# EAGLE schematic mainboard-v1 (EAGLE 7.5.0)
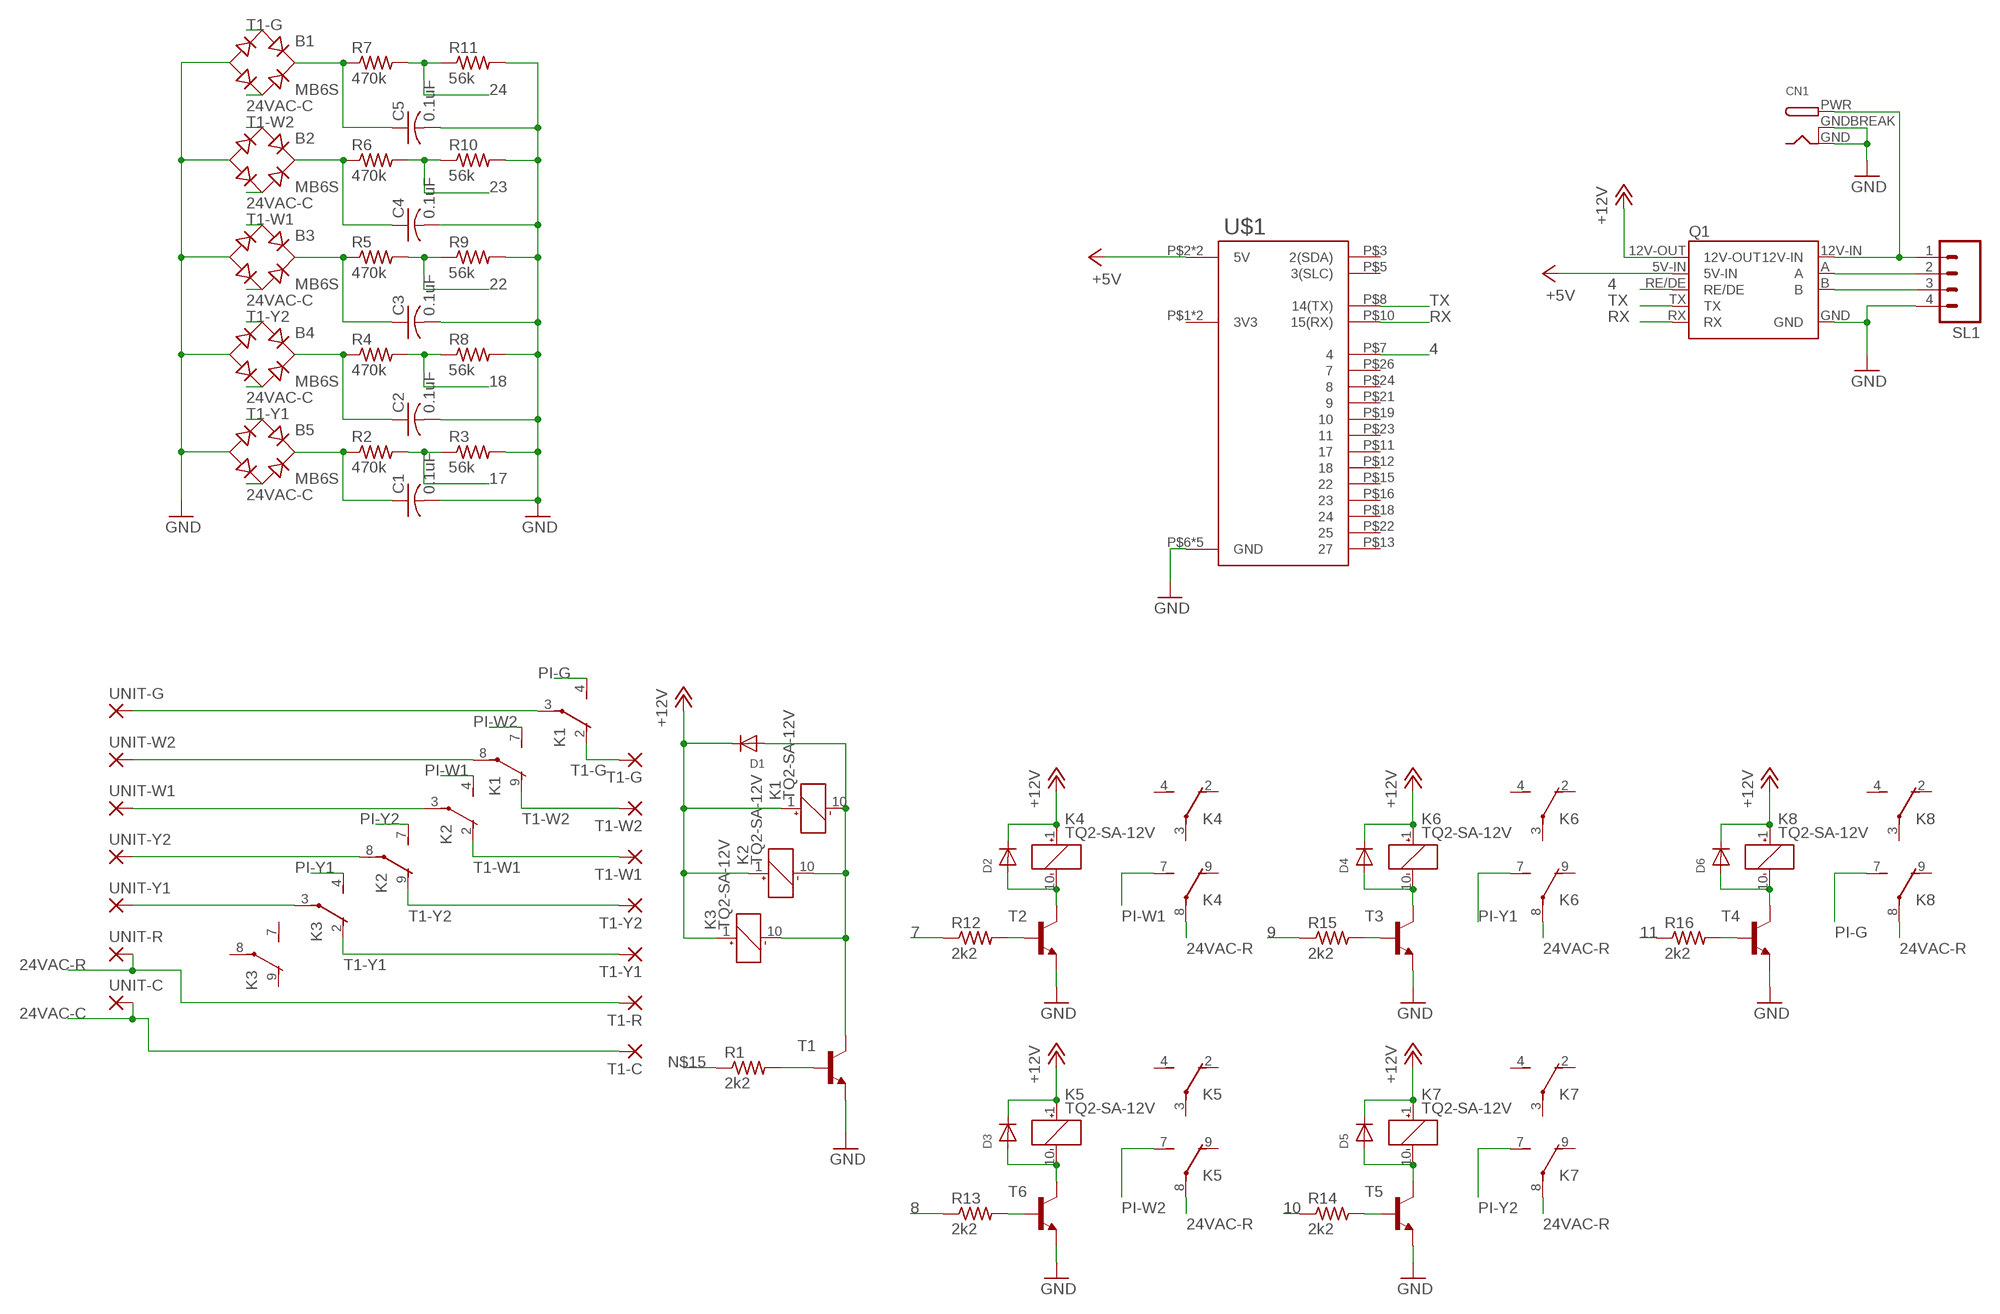
[diagram p0: schematic, sheet 1]

## Parts
B1  MB6S  [SOIC-4]
B2  MB6S  [SOIC-4]
B3  MB6S  [SOIC-4]
B4  MB6S  [SOIC-4]
B5  MB6S  [SOIC-4]
C1  0.1uF  C-USC0603  [C0603]
C2  0.1uF  C-USC0603  [C0603]
C3  0.1uF  C-USC0603  [C0603]
C4  0.1uF  C-USC0603  [C0603]
C5  0.1uF  C-USC0603  [C0603]
CN1  DCBARRELPTH  [DCJACK_2MM_PTH]
D1  DIODESMA  [SMADIODE]
D2  DIODESMA  [SMADIODE]
D3  DIODESMA  [SMADIODE]
D4  DIODESMA  [SMADIODE]
D5  DIODESMA  [SMADIODE]
D6  DIODESMA  [SMADIODE]
K1  TQ2-SA-12V  [TQ-SA]
K2  TQ2-SA-12V  [TQ-SA]
K3  TQ2-SA-12V  [TQ-SA]
K4  TQ2-SA-12V  [TQ-SA]
K5  TQ2-SA-12V  [TQ-SA]
K6  TQ2-SA-12V  [TQ-SA]
K7  TQ2-SA-12V  [TQ-SA]
K8  TQ2-SA-12V  [TQ-SA]
Q1  RS485-ADAPTER0.05-CONNECTOR  [RS485-ADAPTOR-05]
R1  2k2  R-US_R0603  [R0603]
R2  470k  R-US_R0603  [R0603]
R3  56k  R-US_R0603  [R0603]
R4  470k  R-US_R0603  [R0603]
R5  470k  R-US_R0603  [R0603]
R6  470k  R-US_R0603  [R0603]
R7  470k  R-US_R0603  [R0603]
R8  56k  R-US_R0603  [R0603]
R9  56k  R-US_R0603  [R0603]
R10  56k  R-US_R0603  [R0603]
R11  56k  R-US_R0603  [R0603]
R12  2k2  R-US_R0603  [R0603]
R13  2k2  R-US_R0603  [R0603]
R14  2k2  R-US_R0603  [R0603]
R15  2k2  R-US_R0603  [R0603]
R16  2k2  R-US_R0603  [R0603]
SL1  M04  [04P]
T1  BC808-NPN-SOT23-BEC  [SOT23-BEC]
T1-C  1,6/0,9  [1,6/0,9]
T1-G  1,6/0,9  [1,6/0,9]
T1-R  1,6/0,9  [1,6/0,9]
T1-W1  1,6/0,9  [1,6/0,9]
T1-W2  1,6/0,9  [1,6/0,9]
T1-Y1  1,6/0,9  [1,6/0,9]
T1-Y2  1,6/0,9  [1,6/0,9]
T2  BC808-NPN-SOT23-BEC  [SOT23-BEC]
T3  BC808-NPN-SOT23-BEC  [SOT23-BEC]
T4  BC808-NPN-SOT23-BEC  [SOT23-BEC]
T5  BC808-NPN-SOT23-BEC  [SOT23-BEC]
T6  BC808-NPN-SOT23-BEC  [SOT23-BEC]
U$1  RASPI-GPIO  [RASPI-GPIO-1]
UNIT-C  1,6/0,9  [1,6/0,9]
UNIT-G  1,6/0,9  [1,6/0,9]
UNIT-R  1,6/0,9  [1,6/0,9]
UNIT-W1  1,6/0,9  [1,6/0,9]
UNIT-W2  1,6/0,9  [1,6/0,9]
UNIT-Y1  1,6/0,9  [1,6/0,9]
UNIT-Y2  1,6/0,9  [1,6/0,9]

## Nets
4: Q1.RE/DE U$1.P$7
7: R12.1
8: R13.1
9: R15.1
10: R14.1
11: R16.1
17: R2.2 R3.1
18: R4.2 R8.1
22: R5.2 R9.1
23: R6.2 R10.1
24: R7.2 R11.1
24VAC-C: B1.~2(AC2) B2.~2(AC2) B3.~2(AC2) B4.~2(AC2) B5.~2(AC2) T1-C.1(P) UNIT-C.1(P)
24VAC-R: K4.8(2:P) K5.8(2:P) K6.8(2:P) K7.8(2:P) K8.8(2:P) T1-R.1(P) UNIT-R.1(P)
+5V: Q1.5V-IN U$1.P$2(5V) U$1.P$4(5V)
+12V: D1.C D2.C D3.C D4.C D5.C D6.C K1.1(_:+) K2.1(_:+) K3.1(_:+) K4.1(_:+) K5.1(_:+) K6.1(_:+) K7.1(_:+) K8.1(_:+) Q1.12V-OUT
GND: B1.- B2.- B3.- B4.- B5.- C1.2 C2.2 C3.2 C4.2 C5.2 CN1.GND CN1.GNDBREAK Q1.GND R3.2 R8.2 R9.2 R10.2 R11.2 SL1.4 T1.E T2.E T3.E T4.E T5.E T6.E U$1.P$6(GND) U$1.P$9(GND) U$1.P$14(GND) U$1.P$20(GND) U$1.P$25(GND)
N$1: B5.+ C1.1 R2.1
N$2: K1.3(1:P) UNIT-G.1(P)
N$4: K1.8(2:P) UNIT-W2.1(P)
N$5: D1.A K1.10(_:-) K2.10(_:-) K3.10(_:-) T1.C
N$6: R1.2 T1.B
N$7: K3.3(1:P) UNIT-Y1.1(P)
N$8: K2.8(2:P) UNIT-Y2.1(P)
N$9: K2.3(1:P) UNIT-W1.1(P)
N$10: B1.+ C5.1 R7.1
N$13: B4.+ C2.1 R4.1
N$14: B3.+ C3.1 R5.1
N$15: R1.1
N$18: B2.+ C4.1 R6.1
N$19: CN1.PWR Q1.12V-IN SL1.1
N$21: D2.A K4.10(_:-) T2.C
N$23: Q1.A SL1.2
N$24: Q1.B SL1.3
N$25: D3.A K5.10(_:-) T6.C
N$26: D5.A K7.10(_:-) T5.C
N$28: D4.A K6.10(_:-) T3.C
N$31: D6.A K8.10(_:-) T4.C
N$32: R13.2 T6.B
N$33: R12.2 T2.B
N$36: R15.2 T3.B
N$38: R14.2 T5.B
N$40: R16.2 T4.B
PI-G: K1.4(1:S) K8.7(2:S)
PI-W1: K2.4(1:S) K4.7(2:S)
PI-W2: K1.7(2:S) K5.7(2:S)
PI-Y1: K3.4(1:S) K6.7(2:S)
PI-Y2: K2.7(2:S) K7.7(2:S)
RX: Q1.RX U$1.P$10(15(RX))
T1-G: B1.~1(AC1) K1.2(1:O) T1-G.1(P)
T1-W1: B3.~1(AC1) K2.2(1:O) T1-W1.1(P)
T1-W2: B2.~1(AC1) K1.9(2:O) T1-W2.1(P)
T1-Y1: B5.~1(AC1) K3.2(1:O) T1-Y1.1(P)
T1-Y2: B4.~1(AC1) K2.9(2:O) T1-Y2.1(P)
TX: Q1.TX U$1.P$8(14(TX))
Unconnected: K3.7(2:S) K3.8(2:P) K3.9(2:O) K4.2(1:O) K4.3(1:P) K4.4(1:S) K4.9(2:O) K5.2(1:O) K5.3(1:P) K5.4(1:S) K5.9(2:O) K6.2(1:O) K6.3(1:P) K6.4(1:S) K6.9(2:O) K7.2(1:O) K7.3(1:P) K7.4(1:S) K7.9(2:O) K8.2(1:O) K8.3(1:P) K8.4(1:S) K8.9(2:O) U$1.P$3(2(SDA)) U$1.P$5(3(SLC)) U$1.P$11 U$1.P$12 U$1.P$13 U$1.P$15 U$1.P$16 U$1.P$18 U$1.P$19 U$1.P$21 U$1.P$22 U$1.P$23 U$1.P$24 U$1.P$26

## Power pins joined to a net without a drawn wire
3V3: U$1.P$1(3V3) U$1.P$17(3V3)

## Library data of the parts
B1-B5 = rectifier:MB*S: Bridge Rectifier Source: http://www.fairchildsemi.com/ds/MB/MB6S.pdf
C1-C5 = rcl:C-US: CAPACITOR, American symbol
CN1 = adafruit:DCBARREL: 2.0mm DC Barrel Jack DCJACK_2MM_PTH - Through Hole Jack (4UConnector: 05537)
D1-D6 = adafruit:DIODE: Diode SMADIODE - SMA Surface Mount Package 20V 1A Schottky Diode Digikey: 641-1014-6-ND DO-1N4148 - Through Hole Small Current Diode SOD-123 20V 1 A (.5mV Vf) Schottky Diode - Digikey: MBRX120TPMSCT-ND SOD-323 10V 570mA (.38mV Vf, 3ns) Schottky Diode - Digikey: ZLLS410CT-ND SOD-523 30V 30mA Schottky Diode (RB751S-40TE61) - Digikey: RB751S-40TE61CT-ND SOT23-R/W - SOT23 Package (R = Solder Paste/Reflow Ovens, W = Hand-Soldering) BAT54Film 40V 300mA - Digikey: 497-7162-1-ND
K1-K8 = relay:TQ2?*: LOW PROFILE 2 FORM C RELAY NAiS Source: http://www.mew-europe.com/.. en_ds_61020_0001.pdf Source: http://www.mew-europe.com/.. en_ds_61020_0004.pdf; MF: AROMAT/ MATSUSHITA; MPN: TQ2SA-12V; OC_FARNELL: 1124056; OC_NEWARK: 64K3203
Q1 = serge:RS485-ADAPTER
R1-R16 = resistor:R-US_: RESISTOR, American symbol
SL1 = con-amp-quick:M04: AMP QUICK CONNECTOR; OC_FARNELL: unknown; OC_NEWARK: unknown
T1-T6 = transistor:*-NPN-: NPN Transistror BF959 corrected 2008.03.06
T1-C T1-G T1-R T1-W1 T1-W2 T1-Y1 T1-Y2 UNIT-C UNIT-G UNIT-R UNIT-W1 UNIT-W2 UNIT-Y1 UNIT-Y2 = wirepad:1,6/0,9: THROUGH-HOLE PAD
U$1 = serge:RASPI-GPIO